# Altium schematic sheet RP2040_MCU.SchDoc: RP2040 CNC
size B; Author: AM; CompanyName: Expatria Technologies; DrawnBy: A.Marles; Engineer: AM; Organization: Expatria Technolgoies; Address1: Schematic; DocumentNumber: 4; SheetNumber: 4; SheetTotal: 15
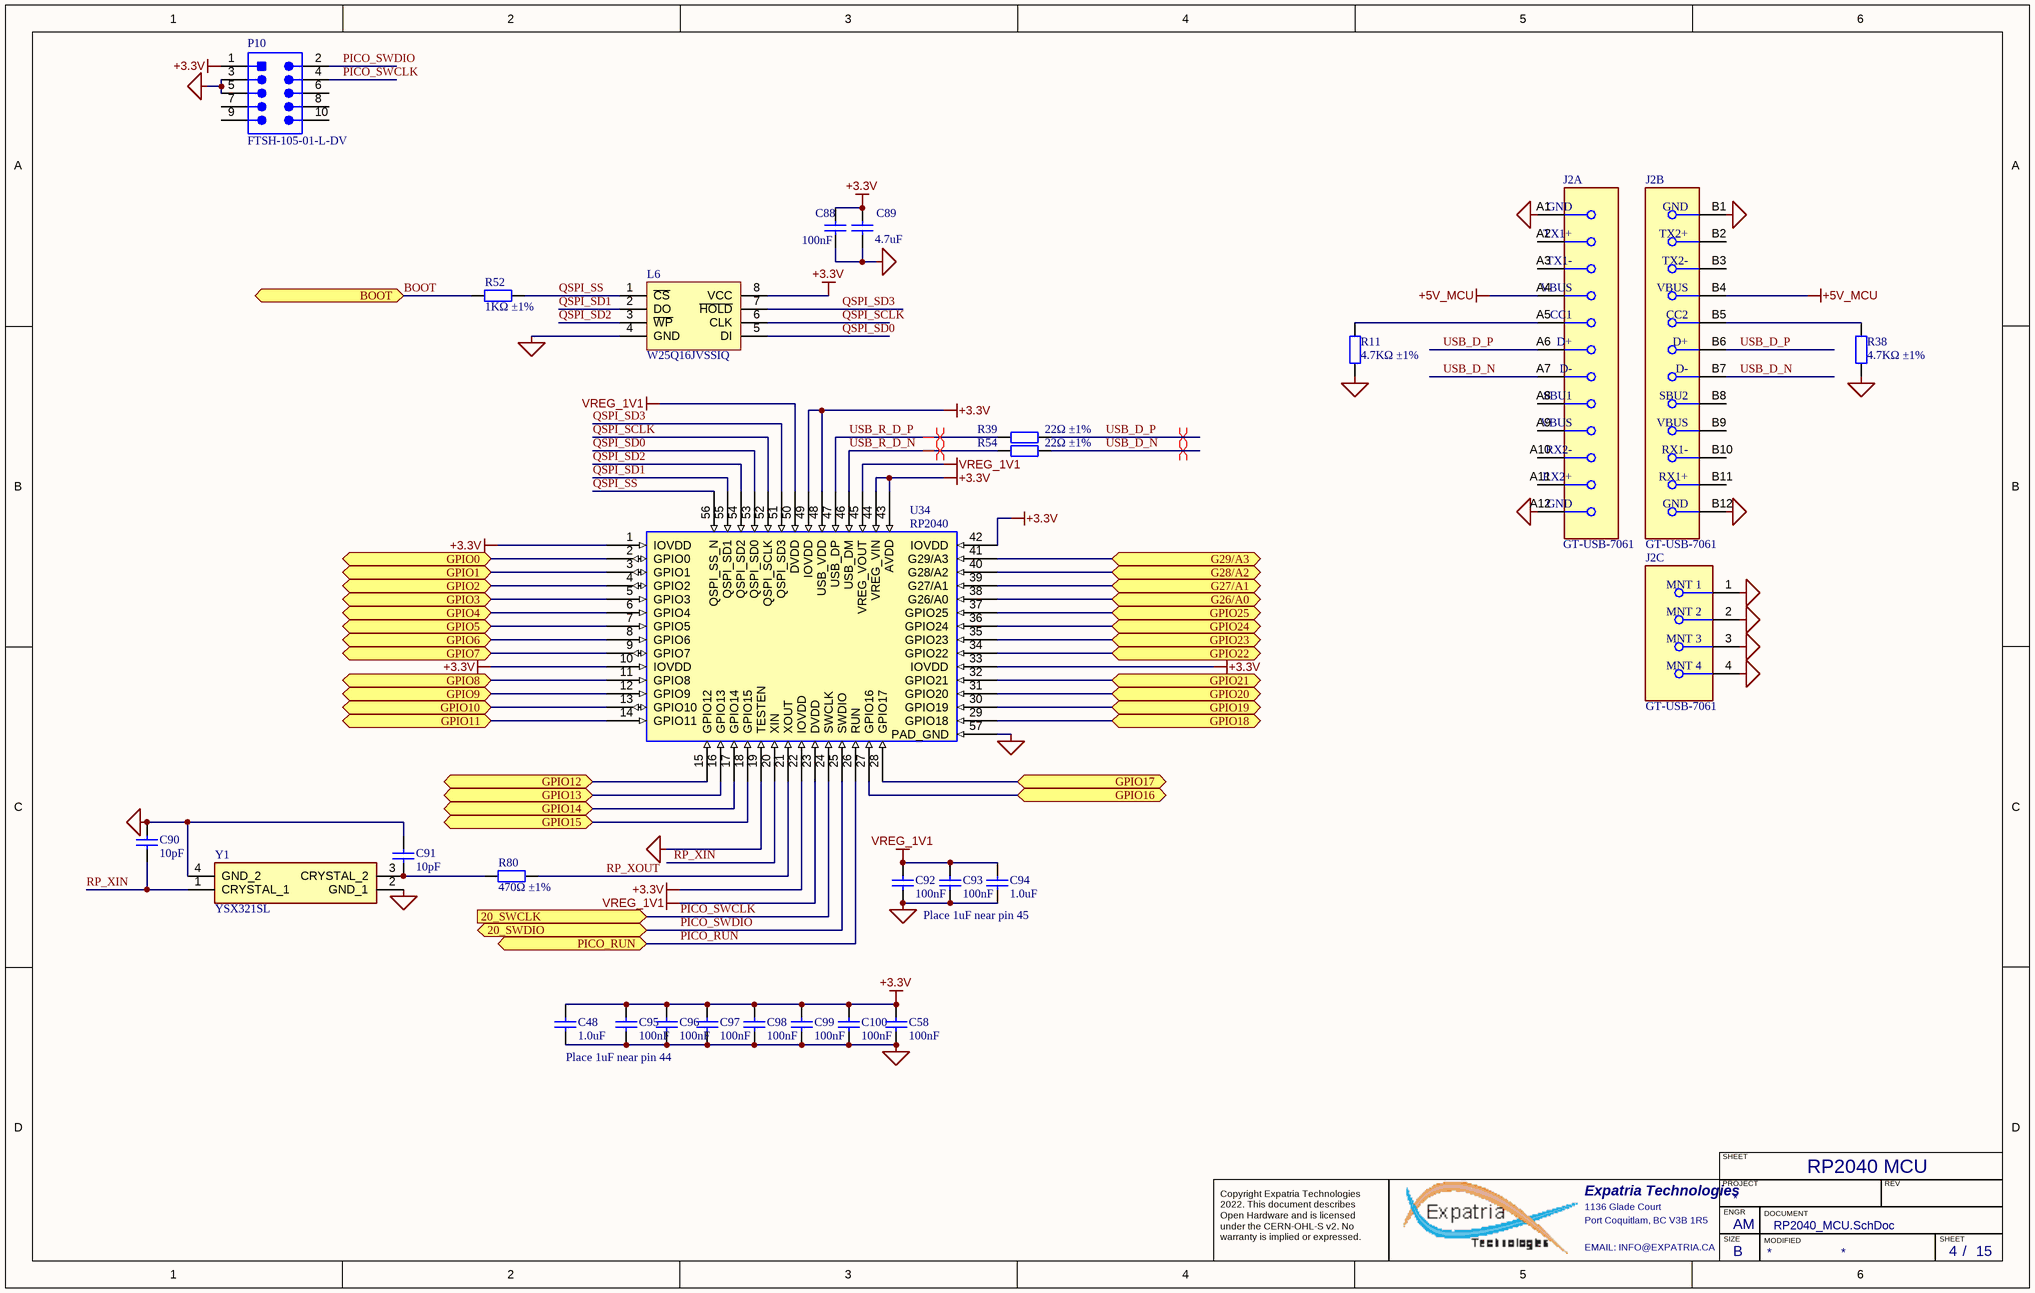
[diagram p0: RP2040_MCU.SchDoc]

## Parts
C48  1.0uF  [0402_C]
C58  100nF  [0402_C]
C88  100nF  [0402_C]
C89  4.7uF  [0402_C]
C90  10pF  [0402_C]
C91  10pF  [0402_C]
C92  100nF  [0402_C]
C93  100nF  [0402_C]
C94  1.0uF  [0402_C]
C95  100nF  [0402_C]
C96  100nF  [0402_C]
C97  100nF  [0402_C]
C98  100nF  [0402_C]
C99  100nF  [0402_C]
C100  100nF  [0402_C]
J2  GT-USB-7061  [USB-C-SMD_GT-USB-7061]  (parts A,B,C of 3)
L6  W25Q16JVSSIQ  [SOIC-8_208mil]
P10  FTSH-105-01-L-DV  [SMTC-FTSH-105-01-L-DV_V]  (no BOM)
R11  4.7KΩ ±1%  [0402_R]
R38  4.7KΩ ±1%  [0402_R]
R39  22Ω ±1%  [0402_R]
R52  1KΩ ±1%  [0402_R]
R54  22Ω ±1%  [0402_R]
R80  470Ω ±1%  [0402_R]
U34  RP2040  [RP2040]
Y1  YSX321SL  [YSX321SL]

## Ports
20_SWCLK (in), 20_SWDIO (bidir), BOOT (bidir), G26/A0 (bidir), G27/A1 (bidir), G28/A2 (bidir), G29/A3 (bidir), GPIO0 (bidir), GPIO1 (bidir), GPIO2 (bidir), GPIO3 (bidir), GPIO4 (bidir), GPIO5 (bidir), GPIO6 (bidir), GPIO7 (bidir), GPIO8 (bidir), GPIO9 (bidir), GPIO10 (bidir), GPIO11 (bidir), GPIO12 (bidir), GPIO13 (bidir), GPIO14 (bidir), GPIO15 (bidir), GPIO16 (bidir), GPIO17 (bidir), GPIO18 (bidir), GPIO19 (bidir), GPIO20 (bidir), GPIO21 (bidir), GPIO22 (bidir), GPIO23 (bidir), GPIO24 (bidir), GPIO25 (bidir), PICO_RUN (bidir)

## Nets
+3.3V: C48.2 C58.2 C88.2 C89.2 C95.2 C96.2 C97.2 C98.2 C99.2 C100.2 L6.8(VCC) P10.1 U34.1(IOVDD) U34.10(IOVDD) U34.22(IOVDD) U34.33(IOVDD) U34.42(IOVDD) U34.43(AVDD) U34.44(VREG_VIN) U34.48(USB_VDD) U34.49(IOVDD)
+5V_MCU: J2.A4(VBUS) J2.B4(VBUS)
GND_CONN: J2.1(MNT_1) J2.2(MNT_2) J2.3(MNT_3) J2.4(MNT_4)
MCU_GND: C48.1 C58.1 C88.1 C89.1 C90.2 C91.2 C92.1 C93.1 C94.1 C95.1 C96.1 C97.1 C98.1 C99.1 C100.1 J2.A1(GND) J2.A12(GND) J2.B1(GND) J2.B12(GND) L6.4(GND) P10.3 P10.5 R11.2 R38.2 U34.19(TESTEN) U34.57(PAD_GND) Y1.2(GND_1) Y1.4(GND_2)
VREG_1V1: C92.2 C93.2 C94.2 U34.23(DVDD) U34.45(VREG_VOUT) U34.50(DVDD)
BOOT: R52.1 ; port BOOT
G26/A0: U34.38(G26/A0) ; port G26/A0
G27/A1: U34.39(G27/A1) ; port G27/A1
G28/A2: U34.40(G28/A2) ; port G28/A2
G29/A3: U34.41(G29/A3) ; port G29/A3
GPIO0: U34.2(GPIO0) ; port GPIO0
GPIO1: U34.3(GPIO1) ; port GPIO1
GPIO2: U34.4(GPIO2) ; port GPIO2
GPIO3: U34.5(GPIO3) ; port GPIO3
GPIO4: U34.6(GPIO4) ; port GPIO4
GPIO5: U34.7(GPIO5) ; port GPIO5
GPIO6: U34.8(GPIO6) ; port GPIO6
GPIO7: U34.9(GPIO7) ; port GPIO7
GPIO8: U34.11(GPIO8) ; port GPIO8
GPIO9: U34.12(GPIO9) ; port GPIO9
GPIO10: U34.13(GPIO10) ; port GPIO10
GPIO11: U34.14(GPIO11) ; port GPIO11
GPIO12: U34.15(GPIO12) ; port GPIO12
GPIO13: U34.16(GPIO13) ; port GPIO13
GPIO14: U34.17(GPIO14) ; port GPIO14
GPIO15: U34.18(GPIO15) ; port GPIO15
GPIO16: U34.27(GPIO16) ; port GPIO16
GPIO17: U34.28(GPIO17) ; port GPIO17
GPIO18: U34.29(GPIO18) ; port GPIO18
GPIO19: U34.30(GPIO19) ; port GPIO19
GPIO20: U34.31(GPIO20) ; port GPIO20
GPIO21: U34.32(GPIO21) ; port GPIO21
GPIO22: U34.34(GPIO22) ; port GPIO22
GPIO23: U34.35(GPIO23) ; port GPIO23
GPIO24: U34.36(GPIO24) ; port GPIO24
GPIO25: U34.37(GPIO25) ; port GPIO25
PICO_RUN: U34.26(RUN) ; port PICO_RUN
PICO_SWCLK: P10.4 U34.24(SWCLK) ; port 20_SWCLK
PICO_SWDIO: P10.2 U34.25(SWDIO) ; port 20_SWDIO
QSPI_SCLK: L6.6(CLK) U34.52(QSPI_SCLK)
QSPI_SD0: L6.5(DI) U34.53(QSPI_SD0)
QSPI_SD1: L6.2(DO) U34.55(QSPI_SD1)
QSPI_SD2: L6.3(~{WP}) U34.54(QSPI_SD2)
QSPI_SD3: L6.7(~{HOLD}) U34.51(QSPI_SD3)
QSPI_SS: L6.1(~{CS}) R52.2 U34.56(QSPI_SS_N)
RP_XIN: C90.1 U34.20(XIN) Y1.1(CRYSTAL_1)
RP_XOUT: R80.2 U34.21(XOUT)
USB_D_N: J2.A7(D-) J2.B7(D-) R54.1
USB_D_P: J2.A6(D+) J2.B6(D+) R39.1
USB_R_D_N: R54.2 U34.46(USB_DM)
USB_R_D_P: R39.2 U34.47(USB_DP)
NetC91_1: C91.1 R80.1 Y1.3(CRYSTAL_2)
NetJ2_A5: J2.A5(CC1) R11.1
NetJ2_B5: J2.B5(CC2) R38.1

Not connected (* = marked no-connect by the designer): J2 A2(TX1+) A3(TX1-) A8(SBU1) A9(VBUS) A10(RX2-) A11(RX2+) B2(TX2+) B3(TX2-) B8(SBU2) B9(VBUS) B10(RX1-) B11(RX1+); P10 6 7 8 9 10

## Layout directives
differential pair: USB_D_N, USB_D_P, USB_R_D_N, USB_R_D_P

## Notes on the sheet
- Place 1uF near pin 45
- Place 1uF near pin 44
- RP2040 MCU
- SHEET
- Expatria Technologies
- 1136 Glade Court
- Port Coquitlam, BC V3B 1R5
- PROJECT
- SIZE
- ENGR
- MODIFIED
- DOCUMENT
- REV
- Copyright Expatria Technologies 2022. This document describes Open Hardware and is licensed under the CERN-OHL-S v2. No warranty is implied or expressed.
- EMAIL: INFO@EXPATRIA.CA
- B
- /

## Library data of the parts
C48 C94 = 0402 1.0uF (105) 10% 25V: Chip capacitor; Manufacturer: Samsung Electro-Mechanics; PartNumber: CL05A105KA5NQNC; Capacitance: 1uF; Tolerance: 10%; Voltage: 25V; ComponentLink1Description: Supplier link; ComponentLink1URL: http://www.szlcsc.com/product/details_53938.html; Package: 0402; Supplier: LC; SuppliersPartNumber: C52923
C58 C88 C92 C93 C95-C100 = 0402 100nF (104) 10% 16V: Chip capacitors; Manufacturer: Samsung Electro-Mechanics; PartNumber: CL05B104KO5NNNC; Tolerance: 10%; Voltage: 16V; ComponentLink1Description: Supplier link; ComponentLink1URL: http://www.szlcsc.com/product/details_1877.html; Package: 0402; Supplier: LC; SuppliersPartNumber: C1525; Capacitance: 100nF
C89 = 0402 4.7uF (475) 20% 10V: Chip capacitor; Manufacturer: Samsung Electro-Mechanics; PartNumber: CL05A475MP5NRNC; Tolerance: 20%; Voltage: 10V; ComponentLink1Description: Supplier link; ComponentLink1URL: http://www.szlcsc.com/product/details_24469.html; Package: 0402; Supplier: LC; SuppliersPartNumber: C23733; Capacitance: 4.7uF
C90 C91 = 0402 10pF (100) 5% 50V: Chip capacitors; Manufacturer: Samsung Electro-Mechanics; PartNumber: CL05C100JB5NNNC; Tolerance: 5%; Voltage: 50V; ComponentLink1Description: Supplier link; ComponentLink1URL: http://www.szlcsc.com/product/details_33914.html; Package: 0402; Supplier: LC; SuppliersPartNumber: C32949; Capacitance: 10pF
J2 = USBC-GT-USB-7061: CONN RCP USB3.1 TYPEC 24P SMD VERT; Manufacturer: G-Switch; Manufacturer Part Number: GT-USB-7061; SuppliersPartNumber: C2762983
L6 = W25Q128JVSIQTR_[C97521]: Flash ROM; SuppliersPartNumber: C131025; ComponentLink1Description: 供应商链接; ComponentLink1URL: https://item.szlcsc.com/98729.html; Package: SOIC-8; Supplier: LC
P10 = CMP-2000-05354-1: Male Header, Pitch 1.27 mm, 2 x 5 Position, Height 5.96 mm, -55 to 125 degC, RoHS, Bulk; Manufacturer: Samtec; Connector Type: Header,Unshrouded; Pitch: 0.050"(1.27mm); Mating Products: FLE-105-01-G-DV-TR-ND-CONNSKT1.27MM10POSDUALSMDCLP-105-02-G-D-P-TR-ND-CONNRCPT10POSDUAL.05"SMDSFMC-105-L2-S-D-TR-ND-CONN.05"SURFACE10POSSMTSFMH-105-02-L-D-TR-ND-CONNRECEPT10POS.50"SMTFLE-105-01-G-DV-A-ND-CONNSKT1.27MM10POSDUALSMDCLP-105-02-G-D-BE-ND-CONNRCPT10POSDUAL.05"SMDFLE-105-01-G-DV-A-P-ND-CONNSKT1.27MM10POSDUALSMDSAM1153-05-ND-CONNRCPT10POSDUAL.05"SMDSAM1155-05-ND-CONNRCPT10POSDUAL.05"SMDSAM1154-05-ND-CONNRCPT10POSDUAL.05"SMDSFMH-105-02-L-D-LC-ND-CONNRECEPT10POS.50"SMTSAM1226-05-ND-CONNRCPT.05"10POSDUALSMD; Catalog Drawings: FTSHSeriesFTSHSeriesSMTSide; Other Names: SAM1161-05; EDA / CAD Models: DownloadfromAcceleratedDesigns; Number of Positions Loaded: All; Number of Positions: 10; Featured Product: Board-To-BoardInterconnectSystems; Online Catalog: FTSHSeries; Product Training Modules: Board-to-BoardConnectors; Category: Connectors,Interconnects; Number of Rows: 2; Contact Finish: Gold; Termination: Solder; Mounting Type: SurfaceMount; Series: FTSH; Contact Mating Length: 0.120"(3.05mm); Row Spacing: 0.050"(1.27mm); Datasheet URL: https://datasheet.ciiva.com/30493/0900766b80adfe36-30493006.pdf; Contact Finish Thickness: 10µin(0.25µm); Features: -; Standard Package: 1; Packaging: Bulk; Datasheet Version: Feb-08; Manufacturer URL: http://www.samtec.com/; Fastening Type: -; Family: RectangularConnectors-Headers,MalePins; Contact Type: MalePin; Color: Black
R11 R38 = 0402 4.7K (4701) 1%: Chip resistor; Manufacturer: Uniroyal Elec; PartNumber: 0402WGF4701TCE; Power: 1/16W; ComponentLink1Description: Supplier link; ComponentLink1URL: http://www.szlcsc.com/product/details_26643.html; Package: 0402; Supplier: LC; SuppliersPartNumber: C25900; Resistance: 4.7KΩ; Tolerance: 1%
R39 R54 = 0402 22R (22R0) 1%: Chip resistor; Manufacturer: Uniroyal Elec; PartNumber: 0402WGF220JTCE; Power: 1/16W; ComponentLink1Description: Supplier link; ComponentLink1URL: http://www.szlcsc.com/product/details_25835.html; Package: 0402; Supplier: LC; SuppliersPartNumber: C25092; Resistance: 22Ω; Tolerance: 1%
R52 = 0402 1K (1001) 1%: Chip resistor; Manufacturer: Uniroyal Elec; PartNumber: 0402WGF1001TCE; Power: 1/16W; ComponentLink1Description: Supplier link; ComponentLink1URL: http://www.szlcsc.com/product/details_12256.html; Package: 0402; Supplier: LC; SuppliersPartNumber: C11702; Resistance: 1KΩ; Tolerance: 1%
R80 = 0402 470R (4700) 1%: Chip resistor; Manufacturer: Uniroyal Elec; PartNumber: 0402WGF4700TCE; Power: 1/16W; ComponentLink1Description: Supplier link; ComponentLink1URL: http://www.szlcsc.com/product/details_25860.html; Package: 0402; Supplier: LC; SuppliersPartNumber: C25117; Resistance: 470Ω; Tolerance: 1%
U34 = RP2040: RP2040 First MCU from RPI
Y1 = YSX321SL: Crystal or Oscillator; Manufacturer_Name: YXC; Datasheet Link: https://datasheet.lcsc.com/szlcsc/YSX321SL-30MHZ-10PF-8PPM_C70576.pdf; Height: 0.8mm; Manufacturer_Part_Number: YSX321SL; SuppliersPartNumber: C9002